# Altium schematic sheet AK4430_1.SchDoc: nRF2789_Dual_Wireless_Mic_RX
size A4; DrawnBy: ANOL; Revision: 1.0
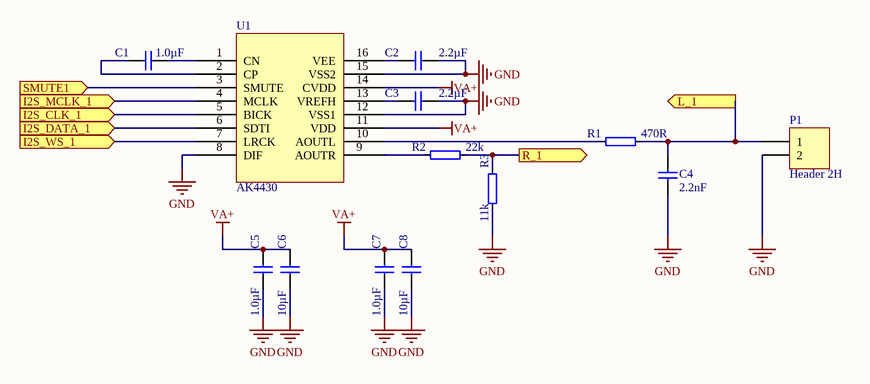
[diagram p0: AK4430_1.SchDoc]

## Parts
C1  1.0µF  [0603s]
C2  2.2µF  [0603s]
C3  2.2µF  [0603s]
C4  2.2nF  [0402s]
C5  1.0µF  [0603s]
C6  10µF  [0805]
C7  1.0µF  [0603s]
C8  10µF  [0805]
P1  Header 2H  [RCA]
R1  470R  [0402s]
R2  22k  [0402s]
R3  11k  [0402s]
U1  AK4430  [TSOP65P640X110-16N]

## Ports
I2S_CLK_1 (in), I2S_DATA_1 (in), I2S_MCLK_1 (in), I2S_WS_1 (in), L_1 (out), R_1 (out), SMUTE1 (in)

## Nets
GND: C2.2 C3.2 C4.1 C5.1 C6.1 C7.1 C8.1 P1.2 R3.1 U1.8(DIF) U1.12(VSS1) U1.15(VSS2)
VA+: C5.2 C6.2 C7.2 C8.2 U1.11(VDD) U1.14(CVDD)
I2S_CLK_1: U1.5(BICK) ; port I2S_CLK_1
I2S_DATA_1: U1.6(SDTI) ; port I2S_DATA_1
I2S_MCLK_1: U1.4(MCLK) ; port I2S_MCLK_1
I2S_WS_1: U1.7(LRCK) ; port I2S_WS_1
L_1: C4.2 P1.1 R1.2 ; port L_1
R_1: R2.2 R3.2 ; port R_1
SMUTE1: U1.3(SMUTE) ; port SMUTE1
NetC1_1: C1.1 U1.2(CP)
NetC1_2: C1.2 U1.1(CN)
NetC2_1: C2.1 U1.16(VEE)
NetC3_1: C3.1 U1.13(VREFH)
NetR1_1: R1.1 U1.10(AOUTL)
NetR2_1: R2.1 U1.9(AOUTR)

## Library data of the parts
C1 C5 C7 = C0603-1µ0: Chip Cap 0603; Note: Chip Cap 10%; Artikkelnr Noca: 20039205; Part Number: C0603-1µ0; Manufacturer: *; Manufacturer Part Number: *; Datasheet: *; LatestRevisionDate: 2009-11-23; Pin Count: 2; Publisher: Nordic Semiconductor; Published: 2009-05-08; Value: 1.0µF; Supplier: *; Supplier part number: *; 2nd source Supplier: *; 2nd source part number: *
C2 C3 = C0603-2µ2: Chip Cap 0603; Note: Chip Cap 1%; Artikkelnr Noca: N.A.; Part Number: C0603-2µ2; Manufacturer: *; Manufacturer Part Number: *; Datasheet: *; LatestRevisionDate: 2009-05-08; Pin Count: 2; Publisher: Nordic Semiconductor; Published: 2009-05-08; Value: 2.2µF; Supplier: *; Supplier part number: *; 2nd source Supplier: *; 2nd source part number: *
C4 = C0402-2n2: Chip Cap 0402; Note: Chip Cap 10%; Artikkelnr Noca: 20039221; Part Number: C0402-2n2; Manufacturer: *; Manufacturer Part Number: *; Datasheet: *; LatestRevisionDate: 2009-11-23; Pin Count: 2; Publisher: Nordic Semiconductor; Published: 2009-05-08; Value: 2.2nF; Supplier: *; Supplier part number: *; 2nd source Supplier: *; 2nd source part number: *
C6 C8 = C0805-10µ: Chip Cap 0805; Note: Chip Cap 10%; Artikkelnr Noca: 20039243; Part Number: C0805-10µ; Manufacturer: *; Manufacturer Part Number: *; Datasheet: *; LatestRevisionDate: 2010-06-03; Pin Count: 2; Publisher: Nordic Semiconductor; Published: 2010-06-03; Value: 10µF; Supplier: *; Supplier part number: *; 2nd source Supplier: *; 2nd source part number: *
P1 = Header 2H: Header, 2-Pin, Right Angle; LatestRevisionDate: 17-Jul-2002; LatestRevisionNote: Re-released for DXP Platform.; Publisher: Altium Limited
R1 = R0402-470: Chip Res 0402; Note: Chip Res 1%; Artikkelnr Noca: 27049065; Part Number: R0402-470; Manufacturer: *; Manufacturer Part Number: *; Datasheet: *; Footprint: 0402; LatestRevisionDate: 2009-11-23; Pin Count: 2; Publisher: Nordic Semiconductor; Published: 2009-05-08; Value: 470R; Supplier: *; Supplier part number: *; 2nd source Supplier: *; 2nd source part number: *
R2 = R0402-22k: Chip Res 0402; Note: Chip Res 1%; Artikkelnr Noca: 27049105; Part Number: R0402-22k; Manufacturer: *; Manufacturer Part Number: *; Datasheet: *; Footprint: 0402; LatestRevisionDate: 2009-11-23; Pin Count: 2; Publisher: Nordic Semiconductor; Published: 2009-05-08; Value: 22k; Supplier: *; Supplier part number: *; 2nd source Supplier: *; 2nd source part number: *
R3 = R0402-10k: Chip Res 0402; Note: Chip Res 1%; Part Number: R0402-10k; Manufacturer: *; Manufacturer Part Number: *; Datasheet: *; Footprint: 0402; LatestRevisionDate: 2009-11-23; Pin Count: 2; Publisher: Nordic Semiconductor; Published: 2009-05-08; Value: 11k; Supplier: *; Supplier part number: *; 2nd source Supplier: *; 2nd source part number: *